# EAGLE design EITMUX (EAGLE 7.5.0)
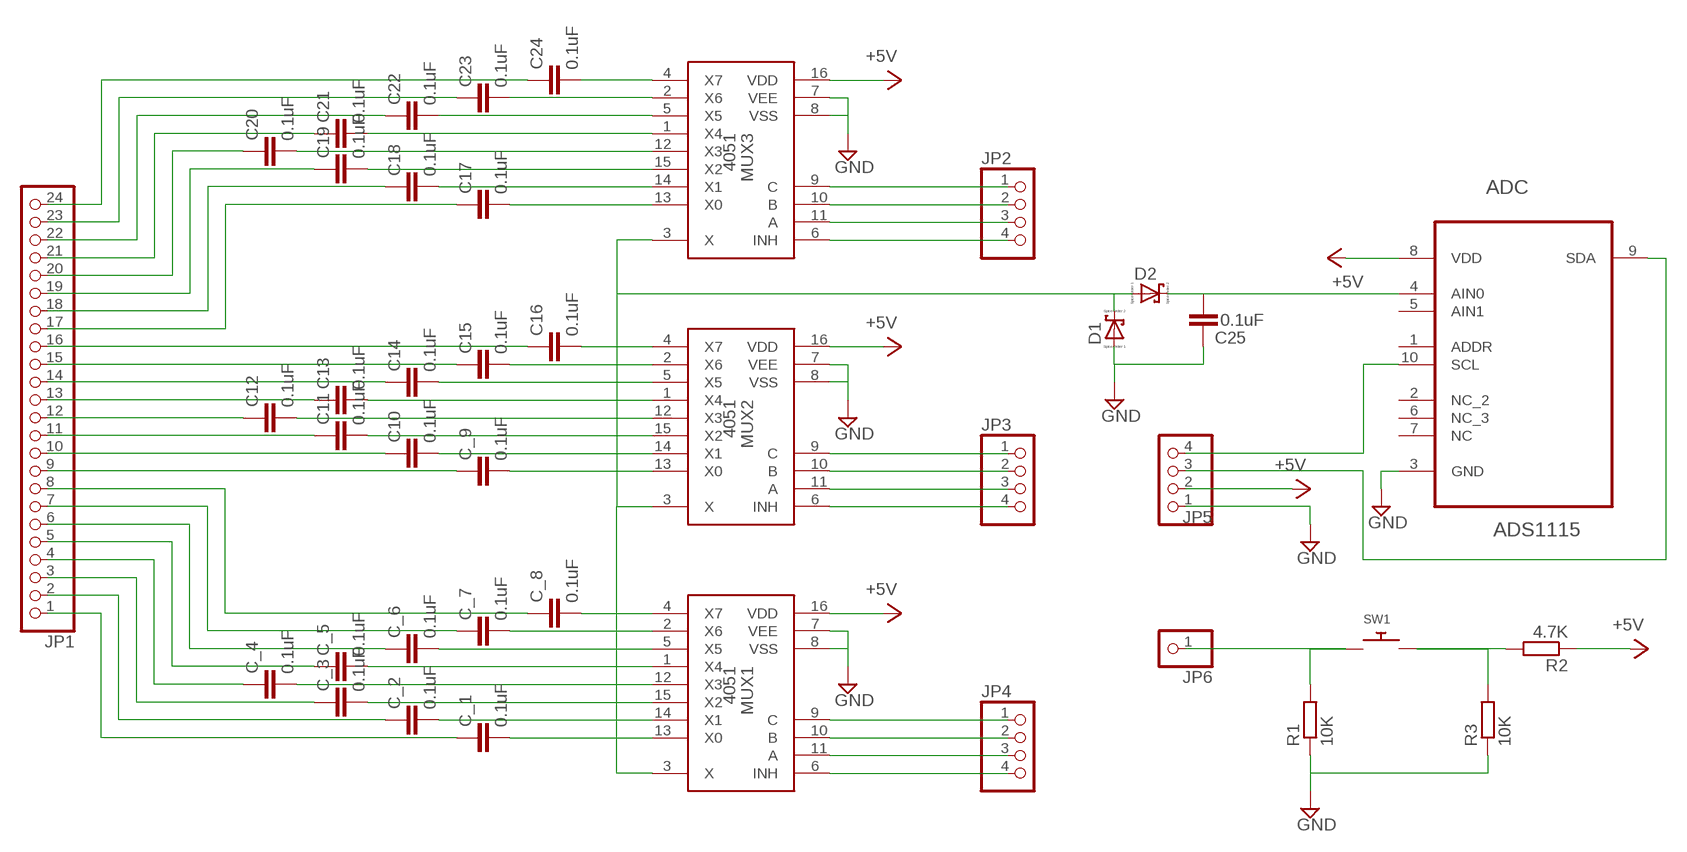
[diagram p0: schematic, sheet 1]

## Parts
ADC  ADS1115  ADS1115IDGSR  [SOP50P490X110-10N]
C10  0.1uF  C-EUC0603  [C0603]
C11  0.1uF  C-EUC0603  [C0603]
C12  0.1uF  C-EUC0603  [C0603]
C13  0.1uF  C-EUC0603  [C0603]
C14  0.1uF  C-EUC0603  [C0603]
C15  0.1uF  C-EUC0603  [C0603]
C16  0.1uF  C-EUC0603  [C0603]
C17  0.1uF  C-EUC0603  [C0603]
C18  0.1uF  C-EUC0603  [C0603]
C19  0.1uF  C-EUC0603  [C0603]
C20  0.1uF  C-EUC0603  [C0603]
C21  0.1uF  C-EUC0603  [C0603]
C22  0.1uF  C-EUC0603  [C0603]
C23  0.1uF  C-EUC0603  [C0603]
C24  0.1uF  C-EUC0603  [C0603]
C25  0.1uF  C-EUC0603  [C0603]
C_1  0.1uF  C-EUC0603  [C0603]
C_2  0.1uF  C-EUC0603  [C0603]
C_3  0.1uF  C-EUC0603  [C0603]
C_4  0.1uF  C-EUC0603  [C0603]
C_5  0.1uF  C-EUC0603  [C0603]
C_6  0.1uF  C-EUC0603  [C0603]
C_7  0.1uF  C-EUC0603  [C0603]
C_8  0.1uF  C-EUC0603  [C0603]
C_9  0.1uF  C-EUC0603  [C0603]
D1  SCHOTTKY-DIODEDO35-7  [DIODE_DO35-7]
D2  SCHOTTKY-DIODEDO35-7  [DIODE_DO35-7]
JP1  PINHD-1X24  [1X24]
JP2  PINHD-1X4  [1X04]
JP3  PINHD-1X4  [1X04]
JP4  PINHD-1X4  [1X04]
JP5  PINHD-1X4  [1X04]
JP6  PINHD-1X1  [1X01]
MUX1  4051  4051JK  [DIL16]
MUX2  4051  4051JK  [DIL16]
MUX3  4051  4051JK  [DIL16]
R1  10K  R-EU_R0603  [R0603]
R2  4.7K  R-EU_R0603  [R0603]
R3  10K  R-EU_R0603  [R0603]
SW1  SWITCH_PUSHBUTTONEVQ-PE  [TACT_PANA-EVQ]

## Nets
+5V: ADC.8(VDD) JP5.2 MUX1.16(VDD) MUX2.16(VDD) MUX3.16(VDD) R2.1
C_11: C10.1 JP1.10
C_12: C11.1 JP1.11
GND: ADC.3(GND) C25.1 D1.A(C) JP5.1 MUX1.7(VEE) MUX1.8(VSS) MUX2.7(VEE) MUX2.8(VSS) MUX3.7(VEE) MUX3.8(VSS) R1.1 R3.1
N$1: C20.2 MUX3.12(X3)
N$2: C19.2 MUX3.15(X2)
N$3: C18.2 MUX3.14(X1)
N$4: C17.2 MUX3.13(X0)
N$5: C16.2 MUX2.4(X7)
N$6: C15.2 MUX2.2(X6)
N$7: C14.2 MUX2.5(X5)
N$8: C13.2 MUX2.1(X4)
N$9: C12.2 MUX2.12(X3)
N$10: C11.2 MUX2.15(X2)
N$11: C10.2 MUX2.14(X1)
N$12: C_9.2 MUX2.13(X0)
N$13: C_8.2 MUX1.4(X7)
N$14: C_7.2 MUX1.2(X6)
N$15: C_6.2 MUX1.5(X5)
N$16: C_5.2 MUX1.1(X4)
N$17: C_4.2 MUX1.12(X3)
N$18: C_3.2 MUX1.15(X2)
N$19: C_2.2 MUX1.14(X1)
N$20: C_1.2 MUX1.13(X0)
N$21: D1.C(A) D2.A(C) MUX1.3(X) MUX2.3(X) MUX3.3(X)
N$22: C24.2 MUX3.4(X7)
N$23: C23.2 MUX3.2(X6)
N$24: C22.2 MUX3.5(X5)
N$25: C_1.1 JP1.1
N$26: C_2.1 JP1.2
N$27: C_3.1 JP1.3
N$28: C_4.1 JP1.4
N$29: C_5.1 JP1.5
N$30: C_6.1 JP1.6
N$31: C_7.1 JP1.7
N$32: C_8.1 JP1.8
N$33: C_9.1 JP1.9
N$34: JP6.1 R1.2 SW1.P$1
N$35: R2.2 R3.2 SW1.P$2
N$36: C12.1 JP1.12
N$37: C13.1 JP1.13
N$38: C14.1 JP1.14
N$39: C15.1 JP1.15
N$40: C16.1 JP1.16
N$41: C20.1 JP1.20
N$42: C19.1 JP1.19
N$43: C18.1 JP1.18
N$44: C17.1 JP1.17
N$45: C21.2 MUX3.1(X4)
N$46: C21.1 JP1.21
N$47: C22.1 JP1.22
N$48: C23.1 JP1.23
N$49: C24.1 JP1.24
N$50: JP2.1 MUX3.9(C)
N$51: JP2.2 MUX3.10(B)
N$52: JP2.3 MUX3.11(A)
N$53: JP2.4 MUX3.6(INH)
N$54: JP3.1 MUX2.9(C)
N$55: JP3.2 MUX2.10(B)
N$56: JP3.3 MUX2.11(A)
N$57: JP3.4 MUX2.6(INH)
N$58: JP4.1 MUX1.9(C)
N$59: JP4.2 MUX1.10(B)
N$60: JP4.3 MUX1.11(A)
N$61: JP4.4 MUX1.6(INH)
N$62: ADC.4(AIN0) C25.2 D2.C(A)
N$63: ADC.10(SCL) JP5.4
N$64: ADC.9(SDA) JP5.3
Unconnected: ADC.1(ADDR) ADC.2(NC_2) ADC.5(AIN1) ADC.6(NC_3) ADC.7(NC)

## Library data of the parts
ADC = Texas Instruments:ADS1115IDGSR: ADC; MPN: ADS1115IDGSR; OC_FARNELL: -; OC_NEWARK: 50R7481; PACKAGE: MSOP-10; SUPPLIER: Texas Instruments
C10-C25 C_1-C_9 = rcl:C-EU: CAPACITOR, European symbol
D1 D2 = eagle-ltspice:SCHOTTKY-DIODE: Schottky Diode; SPICEMODEL: NONE; SPICEPREFIX: D; SPICETYPE: diode
JP1 = pinhead:PINHD-1X24: PIN HEADER
JP2-JP5 = pinhead:PINHD-1X4: PIN HEADER
JP6 = pinhead:PINHD-1X1: PIN HEADER
MUX1-MUX3 = eagle-6.5.0-atari:4051JK
R1-R3 = resistor:R-EU_: RESISTOR, European symbol
SW1 = adafruit:SWITCH_PUSHBUTTON: Buttons SOFTTOUCHSMD_SJ - Soft touch temporary push button (Super Junk Akihabara) Compatible with SKPMANE010 [Mouser: 688-SKPMAN] C&K_KSS = Digikey: KSS221GLFS

## Board
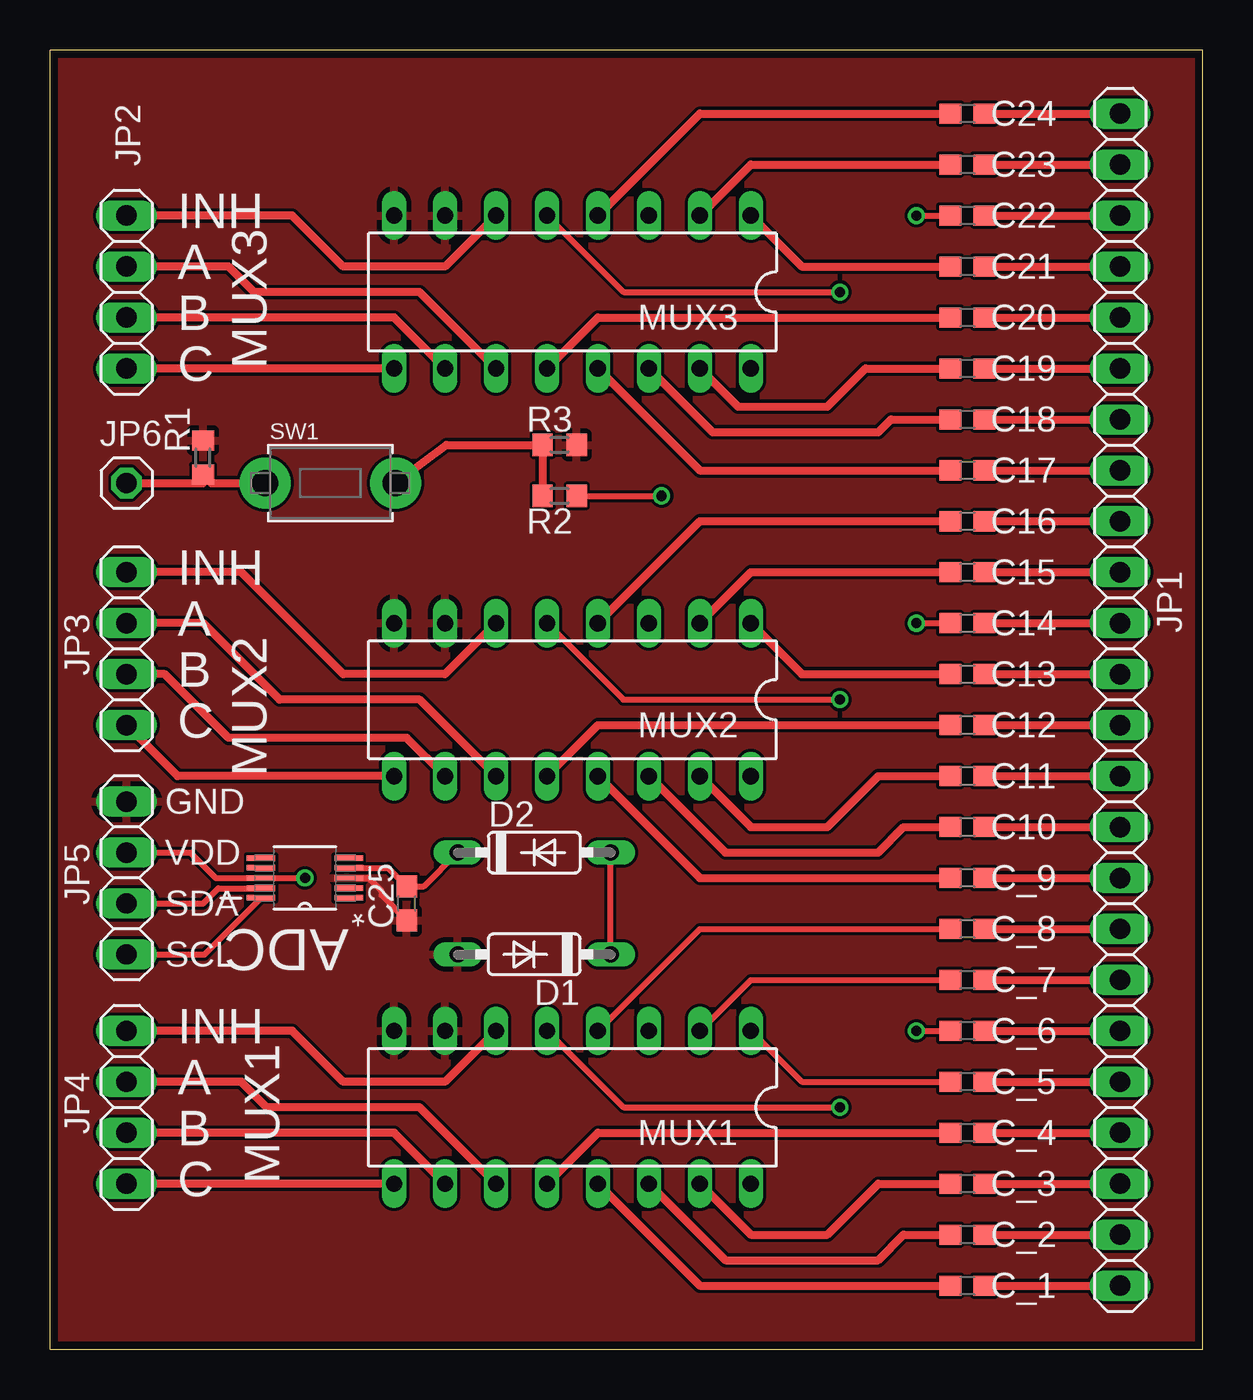
[diagram p1: board, top side]
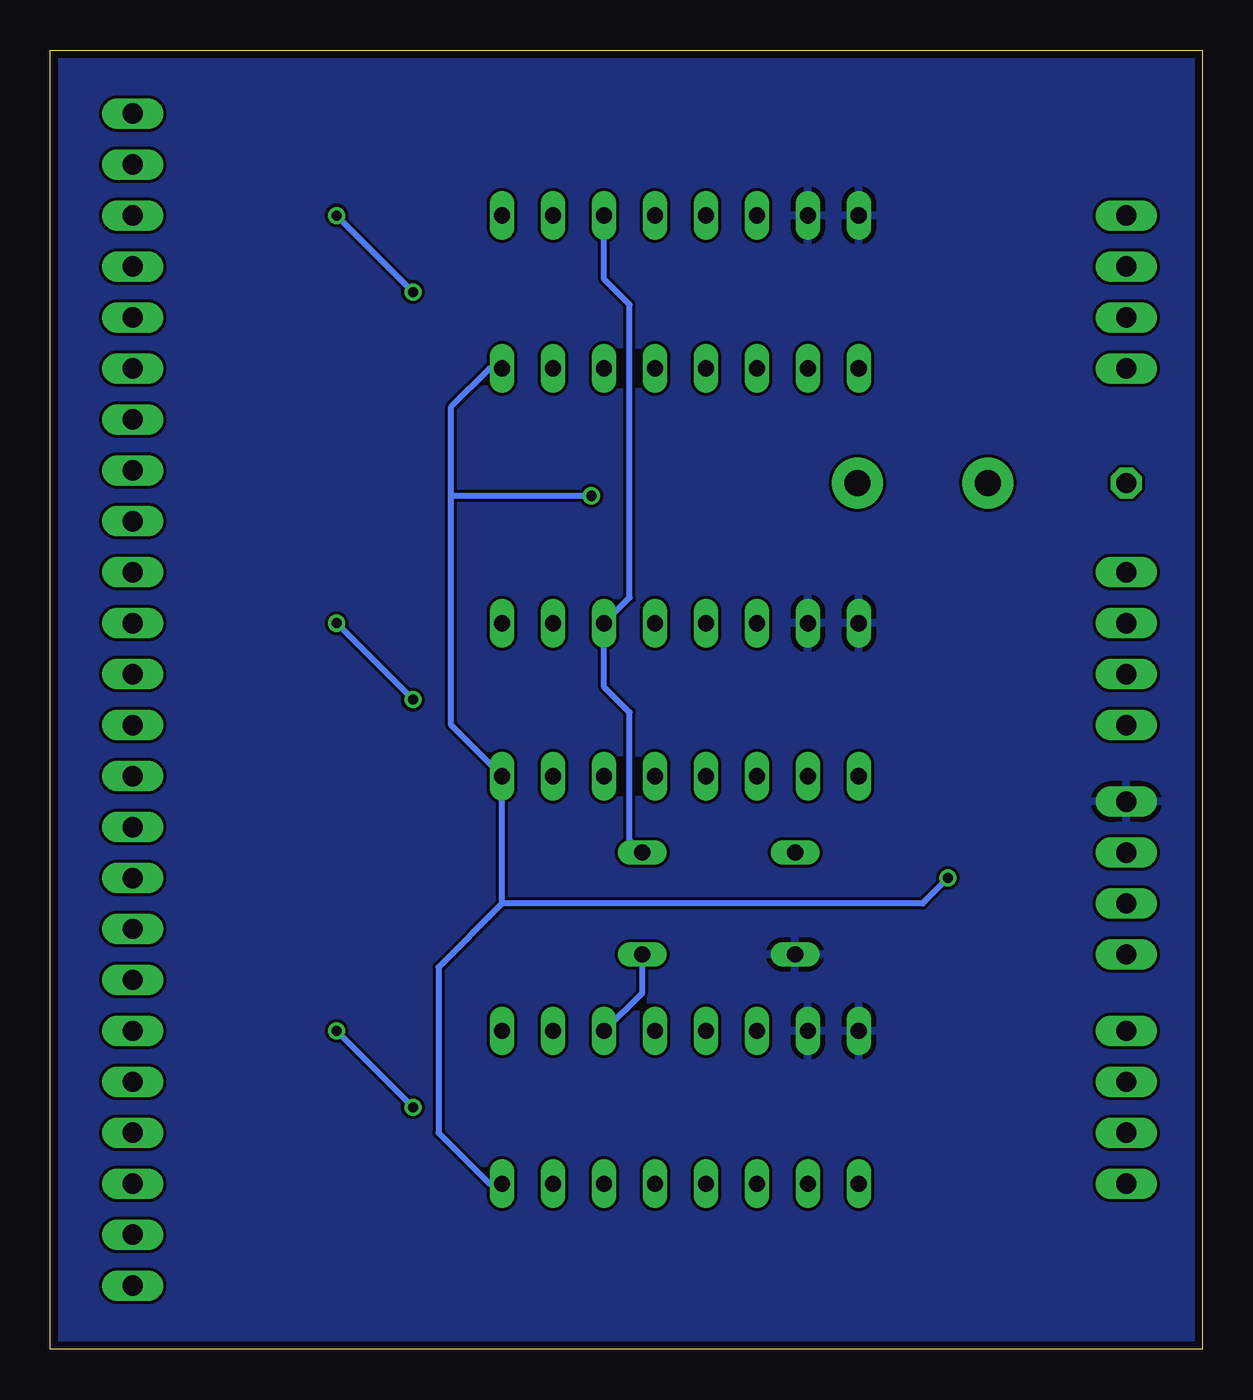
[diagram p2: board, bottom side, seen from below]

Size 57.45 x 64.76 mm. Coordinates in mm from the lower left corner, seen from the top.
Outline: 0,0 57.45,0 57.45,64.76 0,64.76 0,0
Copper layers (1*16): Top 0.0356mm / dielectric 1.5011mm / Bottom 0.0356mm
Design rules "LaenPCBOrder": minimum track width 6mil, minimum drill 13mil, track to track 6mil, track to pad 6mil, pad to pad 6mil, via to via 6mil, smd to smd 6mil, copper to edge 15mil, drill to drill 6mil, minimum pad ring 7mil, minimum via ring 7mil, stop-mask expansion 3mil, vias tented up to drill 0mil, thermal gap 10mil

### Footprints (pad centres in the part's own frame; a part is rotated, then mirrored left to right if it is on the bottom)
SOP50P490X110-10N = smd 1.422 x 0.279: 1 -2.184,0.991; 2 -2.184,0.508; 3 -2.184,0; 4 -2.184,-0.508; 5 -2.184,-0.991; 6 2.184,-0.991; 7 2.184,-0.508; 8 2.184,0; 9 2.184,0.508; 10 2.184,0.991
C0603 = smd 1.1 x 1: 1 -0.85,0; 2 0.85,0
DIODE_DO35-7 = drill 0.813 long: A 3.81,0; C -3.81,0
1X24 = drill 1.016 long: 1 -29.21,0; 2 -26.67,0; 3 -24.13,0; 4 -21.59,0; 5 -19.05,0; 6 -16.51,0; 7 -13.97,0; 8 -11.43,0; 9 -8.89,0; 10 -6.35,0; 11 -3.81,0; 12 -1.27,0; 13 1.27,0; 14 3.81,0; 15 6.35,0; 16 8.89,0; 17 11.43,0; 18 13.97,0; 19 16.51,0; 20 19.05,0; 21 21.59,0; 22 24.13,0; 23 26.67,0; 24 29.21,0
1X04 = drill 1.016 long: 1 -3.81,0; 2 -1.27,0; 3 1.27,0; 4 3.81,0
1X01 = drill 1.016 octagon: 1 0,0
DIL16 = drill 0.813 long: 1 -8.89,-3.81; 2 -6.35,-3.81; 3 -3.81,-3.81; 4 -1.27,-3.81; 5 1.27,-3.81; 6 3.81,-3.81; 7 6.35,-3.81; 8 8.89,-3.81; 9 8.89,3.81; 10 6.35,3.81; 11 3.81,3.81; 12 1.27,3.81; 13 -1.27,3.81; 14 -3.81,3.81; 15 -6.35,3.81; 16 -8.89,3.81
R0603 = smd 1 x 1.1: 1 -0.85,0; 2 0.85,0
TACT_PANA-EVQ = drill 1.3 pad 2.54: P$1 -3.25,0; P$2 3.25,0

### Placement (x,y rotation side)
ADC  12.7,23.5 180 top
C10  45.72,26.04 180 top
C11  45.72,28.57 180 top
C12  45.72,31.11 180 top
C13  45.72,33.66 180 top
C14  45.72,36.2 180 top
C15  45.72,38.73 180 top
C16  45.72,41.27 180 top
C17  45.72,43.81 180 top
C18  45.72,46.35 180 top
C19  45.72,48.9 180 top
C20  45.72,51.44 180 top
C21  45.72,53.98 180 top
C22  45.72,56.52 180 top
C23  45.72,59.05 180 top
C24  45.72,61.59 180 top
C25  17.78,22.23 90 top
C_1  45.72,3.17 180 top
C_2  45.72,5.71 180 top
C_3  45.72,8.26 180 top
C_4  45.72,10.79 180 top
C_5  45.72,13.34 180 top
C_6  45.72,15.88 180 top
C_7  45.72,18.41 180 top
C_8  45.72,20.95 180 top
C_9  45.72,23.5 180 top
D1  24.13,19.68 180 top
D2  24.13,24.77 0 top
JP1  53.34,32.38 90 top
JP2  3.81,52.7 90 top
JP3  3.81,34.92 90 top
JP4  3.81,12.06 90 top
JP5  3.81,23.5 270 top
JP6  3.81,43.18 0 top
MUX1  26.04,12.06 180 top
MUX2  26.04,32.38 180 top
MUX3  26.04,52.7 180 top
R1  7.62,44.45 270 top
R2  25.4,42.55 180 top
R3  25.4,45.09 180 top
SW1  13.97,43.18 0 top

### Tracks (layer width: path | path; a pad name or v marks a point on that pad's centre or on a via)
+5V  (via drill 0.5)
  Top 0.305: v12.7,23.5 ADC.8 8.26,23.5 6.99,24.77 JP5.2 | R2.1 v30.48,42.55
  Bottom 0.305: v12.7,23.5 13.97,22.23 34.92,22.23 | 34.92,22.23 MUX2.16 37.47,31.11 37.47,42.55 | 34.92,22.23 38.1,19.05 38.1,10.79 35.56,8.26 MUX1.16 | 37.47,42.55 37.47,46.99 35.56,48.9 MUX3.16 | v30.48,42.55 37.47,42.55
C_11
  Top 0.406: C10.1 JP1.10
C_12
  Top 0.406: C11.1 JP1.11
GND
  Top 0.305: ADC.3 15.88,23.5 16.51,22.86 16.51,22.64 C25.1
  pour Top: 0,64.77 57.78,64.77 57.78,0 0,0
  pour Bottom: 0,64.77 0,0 57.78,0 57.78,64.77
N$1
  Top 0.406: MUX3.12 27.3,51.44 C20.2
N$2
  Top 0.406: MUX3.15 34.29,46.99 38.73,46.99 40.64,48.9 C19.2
N$3
  Top 0.406: MUX3.14 33.02,45.72 41.27,45.72 41.91,46.35 C18.2
N$4
  Top 0.406: MUX3.13 32.38,43.81 C17.2
N$5
  Top 0.406: MUX2.4 32.38,41.27 C16.2
N$6
  Top 0.406: MUX2.2 34.92,38.73 C15.2
N$7  (via drill 0.5)
  Top 0.305: MUX2.5 28.57,32.38 v39.37,32.38 | v43.18,36.2 C14.2
  Bottom 0.305: v39.37,32.38 v43.18,36.2
N$8
  Top 0.406: MUX2.1 37.47,33.66 C13.2
N$9
  Top 0.406: MUX2.12 27.3,31.11 C12.2
N$10
  Top 0.406: MUX2.15 34.92,26.04 38.73,26.04 41.27,28.57 C11.2
N$11
  Top 0.406: MUX2.14 33.66,24.77 41.27,24.77 42.55,26.04 C10.2
N$12
  Top 0.406: MUX2.13 32.38,23.5 C_9.2
N$13
  Top 0.305: MUX1.4 32.38,20.95 C_8.2
N$14
  Top 0.305: MUX1.2 34.92,18.41 C_7.2
N$15  (via drill 0.5)
  Top 0.305: MUX1.5 28.57,12.06 v39.37,12.06 | v43.18,15.88 C_6.2
  Bottom 0.305: v39.37,12.06 v43.18,15.88
N$16
  Top 0.305: MUX1.1 37.47,13.34 C_5.2
N$17
  Top 0.406: MUX1.12 27.3,10.79 C_4.2
N$18
  Top 0.406: MUX1.15 34.92,5.71 38.73,5.71 41.27,8.26 C_3.2
N$19
  Top 0.406: MUX1.14 33.66,4.45 41.27,4.45 42.55,5.71 C_2.2
N$20
  Top 0.406: MUX1.13 32.38,3.17 C_1.2
N$21
  Top 0.305: D1.C D2.A
  Bottom 0.305: MUX1.3 27.94,17.78 D1.C | D2.A 28.57,25.4 28.57,31.75 29.84,33.02 MUX2.3 28.57,37.47 28.57,52.07 29.84,53.34 MUX3.3
N$22
  Top 0.406: MUX3.4 32.38,61.59 C24.2
N$23
  Top 0.406: MUX3.2 34.92,59.05 C23.2
N$24  (via drill 0.5)
  Top 0.305: MUX3.5 28.57,52.7 v39.37,52.7 | v43.18,56.52 C22.2
  Bottom 0.305: v39.37,52.7 v43.18,56.52
N$25
  Top 0.406: C_1.1 JP1.1
N$26
  Top 0.406: C_2.1 JP1.2
N$27
  Top 0.406: C_3.1 JP1.3
N$28
  Top 0.406: C_4.1 JP1.4
N$29
  Top 0.406: C_5.1 JP1.5
N$30
  Top 0.406: C_6.1 JP1.6
N$31
  Top 0.406: C_7.1 JP1.7
N$32
  Top 0.406: C_8.1 JP1.8
N$33
  Top 0.406: C_9.1 JP1.9
N$34
  Top 0.406: JP6.1 7.62,43.18 R1.2 8.04,43.18 SW1.P$1
N$35
  Top 0.406: SW1.P$2 19.76,45.09 R3.2 R2.2
N$36
  Top 0.406: C12.1 JP1.12
N$37
  Top 0.406: C13.1 JP1.13
N$38
  Top 0.406: C14.1 JP1.14
N$39
  Top 0.406: C15.1 JP1.15
N$40
  Top 0.406: C16.1 JP1.16
N$41
  Top 0.406: C20.1 JP1.20
N$42
  Top 0.406: C19.1 JP1.19
N$43
  Top 0.406: C18.1 JP1.18
N$44
  Top 0.406: C17.1 JP1.17
N$45
  Top 0.406: MUX3.1 37.47,53.98 C21.2
N$46
  Top 0.406: C21.1 JP1.21
N$47
  Top 0.406: C22.1 JP1.22
N$48
  Top 0.406: C23.1 JP1.23
N$49
  Top 0.406: C24.1 JP1.24
N$50
  Top 0.406: MUX3.9 JP2.1
N$51
  Top 0.406: MUX3.10 17.14,51.44 JP2.2
N$52
  Top 0.406: MUX3.11 18.41,52.7 10.16,52.7 8.89,53.98 JP2.3
N$53
  Top 0.406: MUX3.6 19.68,53.98 14.61,53.98 12.06,56.52 JP2.4
N$54
  Top 0.406: MUX2.9 6.35,28.57 JP3.1
N$55
  Top 0.406: MUX2.10 17.78,30.48 8.89,30.48 5.71,33.66 JP3.2
N$56
  Top 0.406: MUX2.11 18.41,32.38 11.43,32.38 7.62,36.2 JP3.3
N$57
  Top 0.406: MUX2.6 19.68,33.66 14.61,33.66 9.53,38.73 JP3.4
N$58
  Top 0.406: MUX1.9 JP4.1
N$59
  Top 0.406: MUX1.10 17.14,10.79 JP4.2
N$60
  Top 0.406: MUX1.11 18.41,12.06 10.79,12.06 9.53,13.34 JP4.3
N$61
  Top 0.406: MUX1.6 19.68,13.34 14.61,13.34 12.06,15.88 JP4.4
N$62
  Top 0.305: ADC.4 16.85,24 C25.2 18.63,23.07 D2.C
N$63
  Top 0.305: JP5.4 7.7,19.68 ADC.10
N$64
  Top 0.305: JP5.3 7.62,22.23 8.38,22.99 ADC.9

### Text on the board
tNames: INH | A | B | MUX3 | C | INH | A | B | C | MUX2 | GND | VDD | SDA | SCL | INH | A | B | C | MUX1